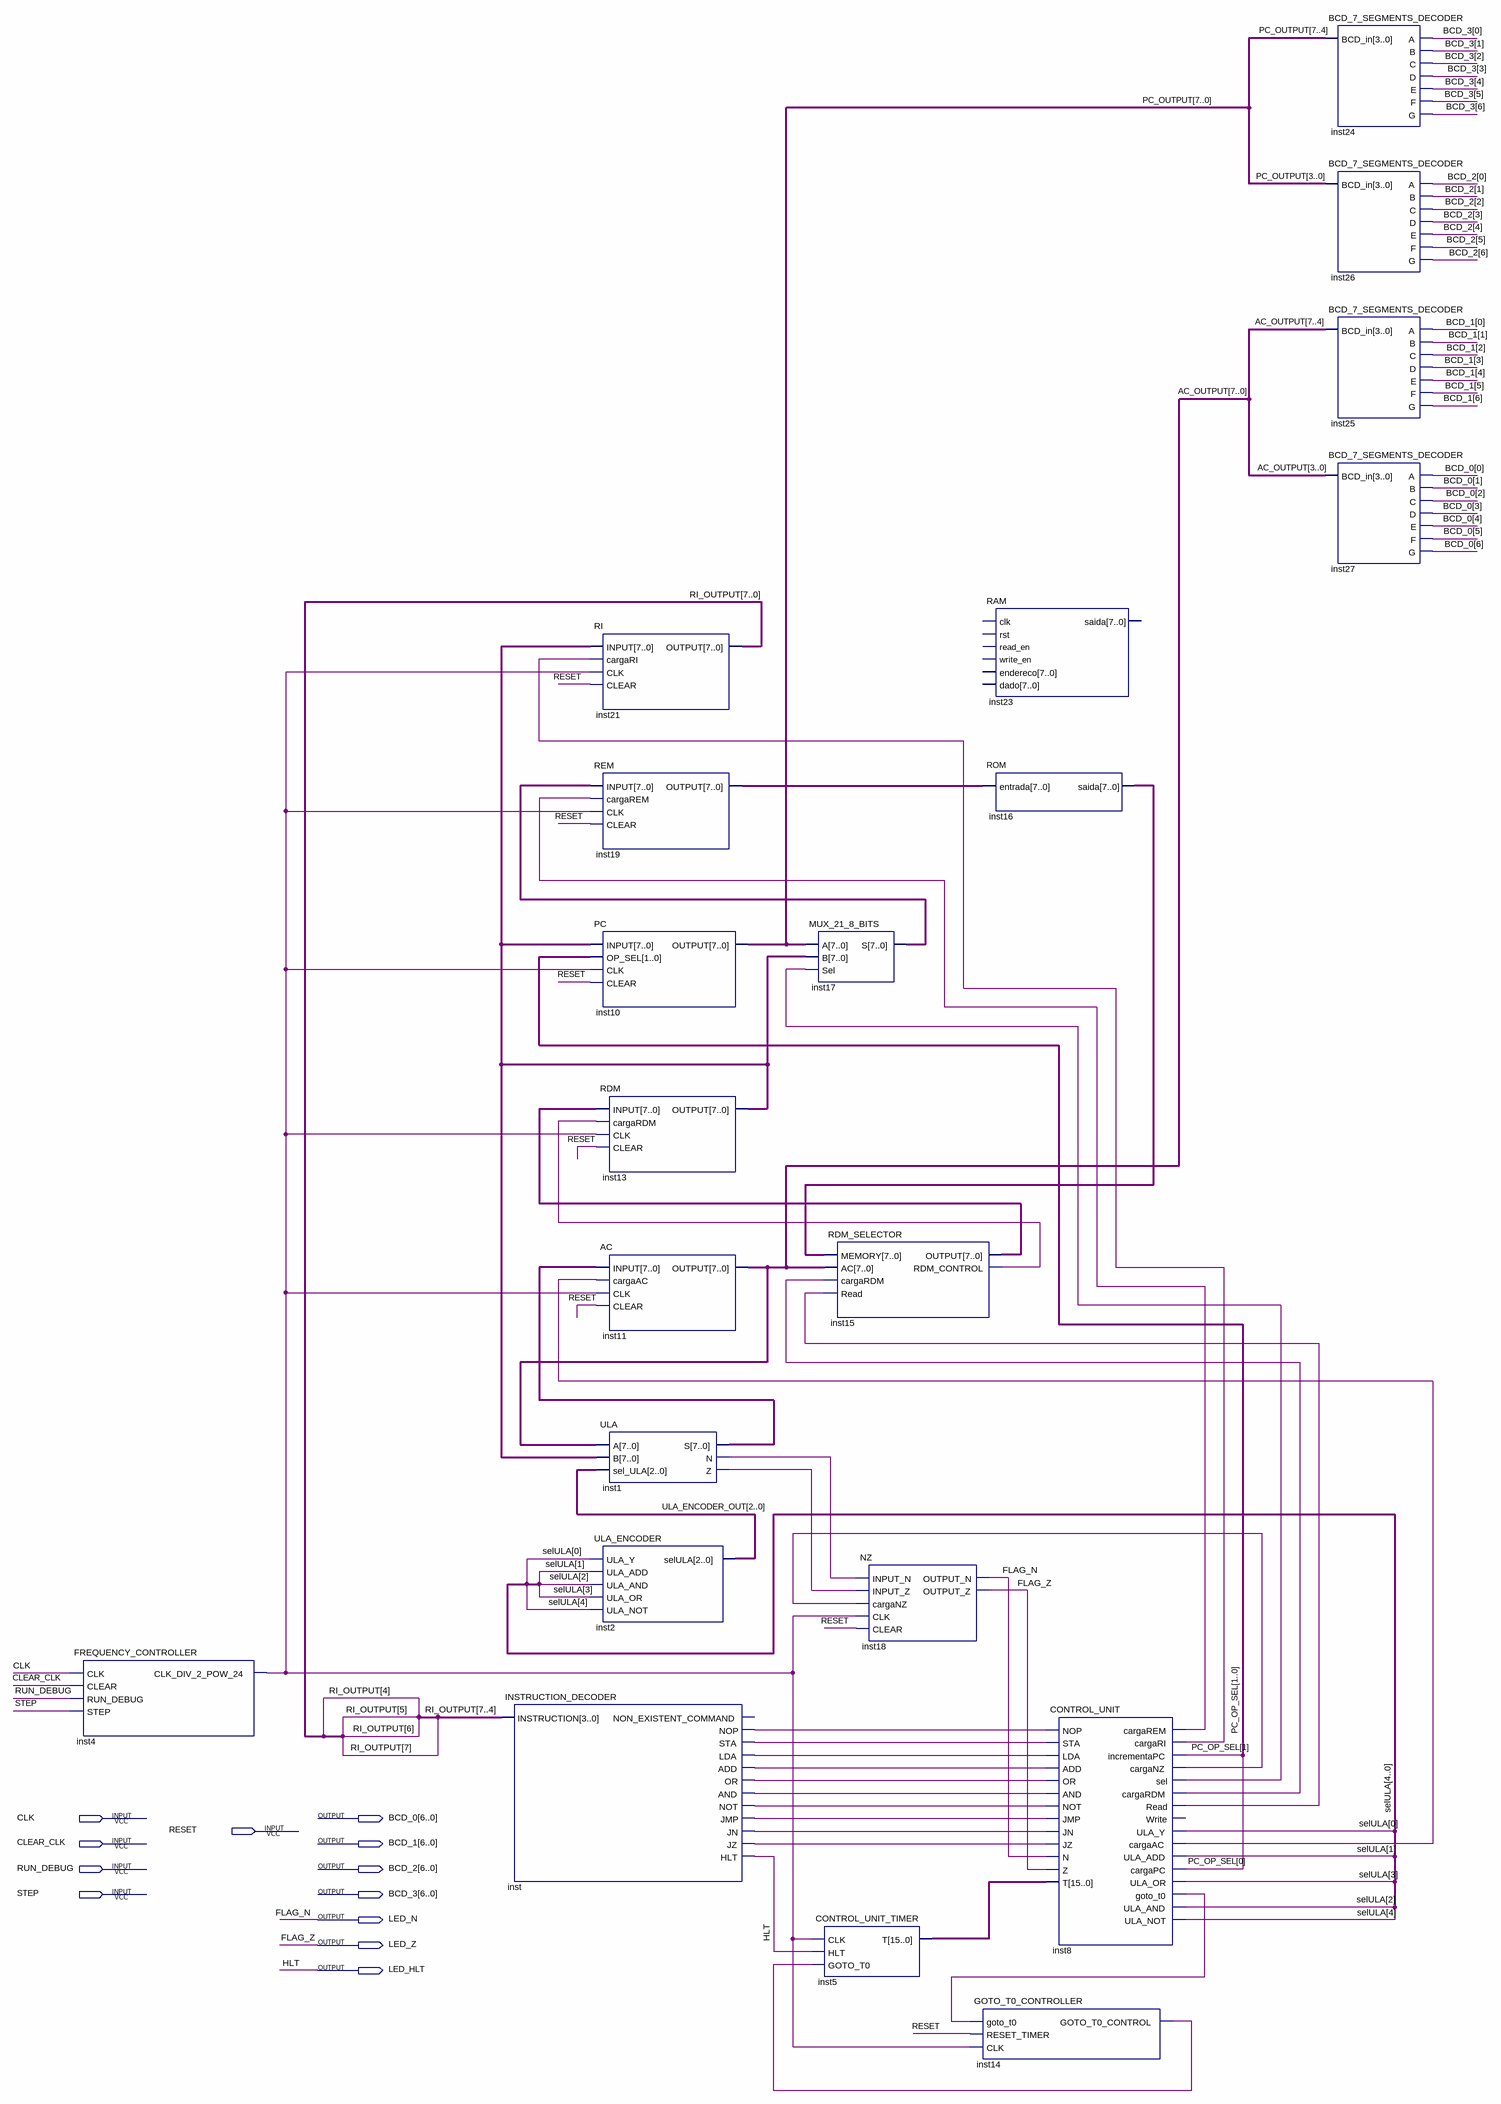
[diagram p0: schematic sheet]
// Quartus schematic NEANDER.bdf as structural Verilog: 21 symbols, 12 pins
module NEANDER (
  input  CLK,
  input  RESET,
  input  CLEAR_CLK,
  input  RUN_DEBUG,
  input  STEP,
  output [6:0] BCD_0,
  output [6:0] BCD_1,
  output [6:0] BCD_2,
  output [6:0] BCD_3,
  output LED_N,
  output LED_Z,
  output LED_HLT
);

  wire inst1_n, inst1_z, inst4_clk_div_2_pow_24, inst8_cargaac, inst8_carganz, inst8_cargardm,
       inst8_cargarem, inst8_cargari, inst8_goto_t0, inst8_read, inst8_sel, inst14_goto_t0_control,
       inst15_rdm_control, inst_add, inst_and, inst_jmp, inst_jn, inst_jz, inst_lda, inst_nop, inst_not,
       inst_or, inst_sta;
  wire [1:0] PC_OP_SEL;
  wire [2:0] ULA_ENCODER_OUT;
  wire [4:0] selULA;
  wire [7:0] AC_OUTPUT, inst1_s, inst13_output, inst15_output, inst16_saida, inst17_s, inst19_output,
       PC_OUTPUT, RI_OUTPUT;
  wire [15:0] inst5_t;

  FREQUENCY_CONTROLLER inst4 (
    .CLK(CLK), .CLEAR(CLEAR_CLK), .RUN_DEBUG(RUN_DEBUG), .STEP(STEP),
    .CLK_DIV_2_POW_24(inst4_clk_div_2_pow_24));
  INSTRUCTION_DECODER inst (
    .INSTRUCTION(RI_OUTPUT[7:4]), .NOP(inst_nop), .STA(inst_sta), .LDA(inst_lda), .ADD(inst_add),
    .OR(inst_or), .AND(inst_and), .NOT(inst_not), .JMP(inst_jmp), .JN(inst_jn), .JZ(inst_jz), .HLT(LED_HLT));  // open: NON_EXISTENT_COMMAND
  RI inst21 (
    .INPUT(inst13_output), .cargaRI(inst8_cargari), .CLK(inst4_clk_div_2_pow_24), .CLEAR(RESET),
    .OUTPUT(RI_OUTPUT));
  REM inst19 (
    .INPUT(inst17_s), .cargaREM(inst8_cargarem), .CLK(inst4_clk_div_2_pow_24), .CLEAR(RESET),
    .OUTPUT(inst19_output));
  PC inst10 (
    .INPUT(inst13_output), .OP_SEL(PC_OP_SEL), .CLK(inst4_clk_div_2_pow_24), .CLEAR(RESET), .OUTPUT(PC_OUTPUT));
  RDM inst13 (
    .INPUT(inst15_output), .cargaRDM(inst15_rdm_control), .CLK(inst4_clk_div_2_pow_24), .CLEAR(RESET),
    .OUTPUT(inst13_output));
  AC inst11 (.INPUT(inst1_s), .cargaAC(inst8_cargaac), .CLK(inst4_clk_div_2_pow_24), .CLEAR(RESET), .OUTPUT(AC_OUTPUT));
  ULA inst1 (.A(AC_OUTPUT), .B(inst13_output), .sel_ULA(ULA_ENCODER_OUT), .S(inst1_s), .N(inst1_n), .Z(inst1_z));
  ULA_ENCODER inst2 (
    .ULA_Y(selULA[0]), .ULA_ADD(selULA[1]), .ULA_AND(selULA[2]), .ULA_OR(selULA[3]), .ULA_NOT(selULA[4]),
    .selULA(ULA_ENCODER_OUT));
  MUX_21_8_BITS inst17 (.A(PC_OUTPUT), .B(inst13_output), .Sel(inst8_sel), .S(inst17_s));
  RDM_SELECTOR inst15 (
    .MEMORY(inst16_saida), .AC(AC_OUTPUT), .cargaRDM(inst8_cargardm), .Read(inst8_read),
    .OUTPUT(inst15_output), .RDM_CONTROL(inst15_rdm_control));
  CONTROL_UNIT_TIMER inst5 (.CLK(inst4_clk_div_2_pow_24), .HLT(LED_HLT), .GOTO_T0(inst14_goto_t0_control), .T(inst5_t));
  NZ inst18 (
    .INPUT_N(inst1_n), .INPUT_Z(inst1_z), .cargaNZ(inst8_carganz), .CLK(inst4_clk_div_2_pow_24),
    .CLEAR(RESET), .OUTPUT_N(LED_N), .OUTPUT_Z(LED_Z));
  RAM inst23 ();  // open: clk, rst, read_en, write_en, endereco, dado, saida
  ROM inst16 (.entrada(inst19_output), .saida(inst16_saida));
  GOTO_T0_CONTROLLER inst14 (
    .goto_t0(inst8_goto_t0), .RESET_TIMER(RESET), .CLK(inst4_clk_div_2_pow_24),
    .GOTO_T0_CONTROL(inst14_goto_t0_control));
  CONTROL_UNIT inst8 (
    .NOP(inst_nop), .STA(inst_sta), .LDA(inst_lda), .ADD(inst_add), .OR(inst_or), .AND(inst_and),
    .NOT(inst_not), .JMP(inst_jmp), .JN(inst_jn), .JZ(inst_jz), .N(LED_N), .Z(LED_Z), .T(inst5_t),
    .cargaREM(inst8_cargarem), .cargaRI(inst8_cargari), .incrementaPC(PC_OP_SEL[1]), .cargaNZ(inst8_carganz),
    .sel(inst8_sel), .cargaRDM(inst8_cargardm), .Read(inst8_read), .ULA_Y(selULA[0]),
    .cargaAC(inst8_cargaac), .ULA_ADD(selULA[1]), .cargaPC(PC_OP_SEL[0]), .ULA_OR(selULA[3]),
    .goto_t0(inst8_goto_t0), .ULA_AND(selULA[2]), .ULA_NOT(selULA[4]));  // open: Write
  BCD_7_SEGMENTS_DECODER inst24 (
    .BCD_in(PC_OUTPUT[7:4]), .A(BCD_3[0]), .B(BCD_3[1]), .C(BCD_3[2]), .D(BCD_3[3]), .E(BCD_3[4]),
    .F(BCD_3[5]), .G(BCD_3[6]));
  BCD_7_SEGMENTS_DECODER inst26 (
    .BCD_in(PC_OUTPUT[3:0]), .A(BCD_2[0]), .B(BCD_2[1]), .C(BCD_2[2]), .D(BCD_2[3]), .E(BCD_2[4]),
    .F(BCD_2[5]), .G(BCD_2[6]));
  BCD_7_SEGMENTS_DECODER inst25 (
    .BCD_in(AC_OUTPUT[7:4]), .A(BCD_1[0]), .B(BCD_1[1]), .C(BCD_1[2]), .D(BCD_1[3]), .E(BCD_1[4]),
    .F(BCD_1[5]), .G(BCD_1[6]));
  BCD_7_SEGMENTS_DECODER inst27 (
    .BCD_in(AC_OUTPUT[3:0]), .A(BCD_0[0]), .B(BCD_0[1]), .C(BCD_0[2]), .D(BCD_0[3]), .E(BCD_0[4]),
    .F(BCD_0[5]), .G(BCD_0[6]));

  // Other names for the same wires on the sheet: FLAG_N = LED_N; FLAG_Z = LED_Z; HLT = LED_HLT
endmodule
